# EAGLE design camara (EAGLE 9.6.1)
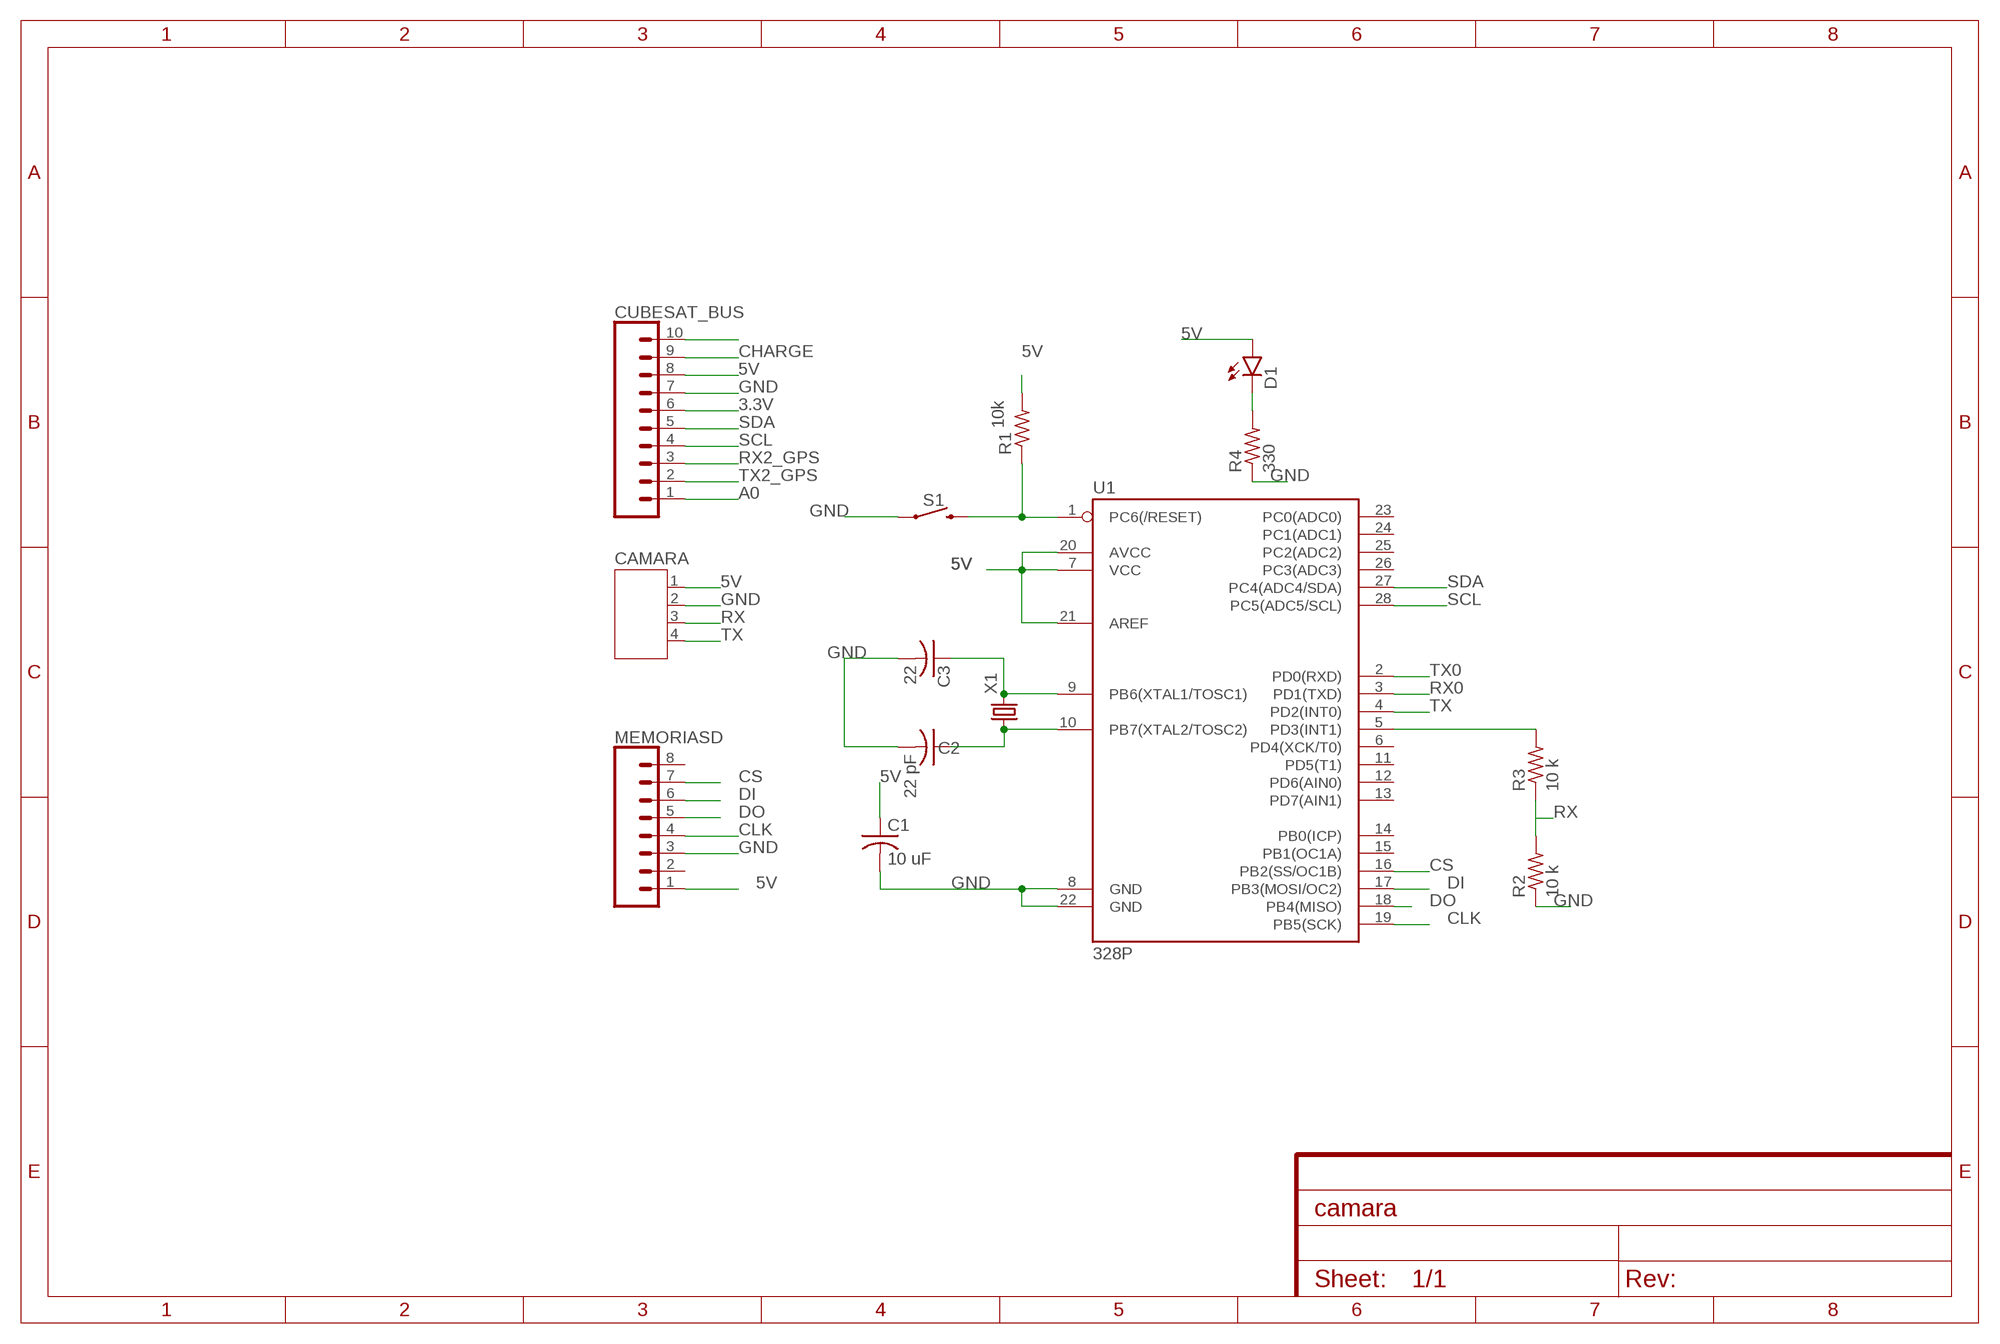
[diagram p0: schematic, sheet 1]

## Parts
C1  10 uF  C-US025-025X050  [C025-025X050]
C2  22 pF  C-US025-025X050  [C025-025X050]
C3  22  C-US025-025X050  [C025-025X050]
CAMARA  JST-PH4  [JST-PH4]
CUBESAT_BUS  CONN_10"  [1X10]
D1  BEAGLEBONE_BLUE_LED-3MM-NO_SILK  [BEAGLEBONE_BLUE_BEAGLEBONE_BLUE_LED3MM-NS]
MEMORIASD  CONN_08"  [1X08]
R1  R-US_0204/7  [0204/7]
R2  10 k  R-US_0204/7  [0204/7]
R3  10 k  R-US_0204/7  [0204/7]
R4  330  R-US_0204/7  [0204/7]
S1  MOMENTARY-SWITCH-SPST-PTH-6.0MM  [TACTILE_SWITCH_PTH_6.0MM]
U1  328P  ATMEGA328P_PDIP  [DIP28]
X1  CRYSTALS-NOGND-HC49  [HC49]

## Nets
3.3V: CUBESAT_BUS.6
5V: C1.1 CAMARA.1 CUBESAT_BUS.8 D1.A MEMORIASD.1 R1.2 U1.7(VCC) U1.20(AVCC) U1.21(AREF)
A0: CUBESAT_BUS.1
CHARGE: CUBESAT_BUS.9
CLK: MEMORIASD.4 U1.19(PB5(SCK))
CS: MEMORIASD.7 U1.16(PB2(SS/OC1B))
DI: MEMORIASD.6 U1.17(PB3(MOSI/OC2))
DO: MEMORIASD.5 U1.18(PB4(MISO))
GND: C1.2 C2.2 C3.2 CAMARA.2 CUBESAT_BUS.7 MEMORIASD.3 R2.1 R4.1 S1.1 U1.8(GND) U1.22(GND)
N$1: R1.1 S1.3 U1.1(PC6(/RESET))
N$2: C3.1 U1.9(PB6(XTAL1/TOSC1)) X1.2
N$3: C2.1 U1.10(PB7(XTAL2/TOSC2)) X1.1
N$4: R3.2 U1.5(PD3(INT1))
N$5: D1.K(C) R4.2
N$6: CUBESAT_BUS.10
RX: CAMARA.3 R2.2 R3.1
RX0: U1.3(PD1(TXD))
RX2_GPS: CUBESAT_BUS.3
SCL: CUBESAT_BUS.4 U1.28(PC5(ADC5/SCL))
SDA: CUBESAT_BUS.5 U1.27(PC4(ADC4/SDA))
TX: CAMARA.4 U1.4(PD2(INT0))
TX0: U1.2(PD0(RXD))
TX2_GPS: CUBESAT_BUS.2
Unconnected: MEMORIASD.2 MEMORIASD.8 U1.6(PD4(XCK/T0)) U1.11(PD5(T1)) U1.12(PD6(AIN0)) U1.13(PD7(AIN1)) U1.14(PB0(ICP)) U1.15(PB1(OC1A)) U1.23(PC0(ADC0)) U1.24(PC1(ADC1)) U1.25(PC2(ADC2)) U1.26(PC3(ADC3))

## Library data of the parts
C1-C3 = rcl:C-US: CAPACITOR, American symbol; SPICEPREFIX: C
CAMARA = jst-ph:JST-PH4
CUBESAT_BUS = SparkFun-Connectors:CONN_10: Multi connection point. Often used as Generic Header-pin footprint for 0.1 inch spaced/style header connections On any of the 0.1 inch spaced packages, you can populate with these: Break Away Headers - Straight <https://www.sparkfun.com/products/116> (PRT-00116) Break Away Male Headers - Right Angle <https://www.sparkfun.com/products/553> (PRT-00553) Female Headers <https://www.sparkfun.com/products/115> (PRT-00115) Break Away Headers - Machine Pin <https://www.sparkfun.com/products/117> (PRT-00117) Break Away Female Headers - Swiss Machine Pin <https://www.sparkfun.com/products/743> (PRT-00743) Arduino Stackable Header - 10 Pin <https://www.sparkfun.com/products/11376> (PRT-11376) For SCREWTERMINALS and SPRING TERMINALS visit here: Screw Terimnals on SparkFun.com <https://www.sparkfun.com/search/results?term=Screw+Terminals> (5mm/3.5mm/2.54mm spacing) This device is also useful as a general connection point to wire up your design to another part of your project. Our various solder wires solder well into these plated through hole pads. Hook-Up Wire - Assortment (Stranded, 22 AWG) <https://www.sparkfun.com/products/11375> (PRT-11375) Hook-Up Wire - Assortment (Solid Core, 22 AWG) <https://www.sparkfun.com/products/11367> (PRT-11367) View the entire wire category on our website here <https://www.sparkfun.com/categories/141> Special notes: Molex polarized connector foot print use with SKU : PRT-08231 with associated crimp pins and housings. 1MM SMD Version SKU: PRT-10208 NOTES ON THE VARIANTS LOCK and LOCK_LONGPADS... This footprint was designed to help hold the alignment of a through-hole component (i.e. 6-pin header) while soldering it into place. You may notice that each hole has been shifted either up or down by 0.005 of an inch from it's more standard position (which is a perfectly straight line). This slight alteration caused the pins (the squares in the middle) to touch the edges of the holes. Because they are alternating, it causes a "brace" to hold the component in place. 0.005 has proven to be the perfect amount of "off-center" position when using our standard breakaway headers. Although looks a little odd when you look at the bare footprint, once you have a header in there, the alteration is very hard to notice. Also,if you push a header all the way into place, it is covered up entirely on the bottom side.; PROD_ID: CONN-11563
D1 = BeagleBone_Blue_R3:BEAGLEBONE_BLUE_LED: LEDs Standard schematic elements and footprints for 5mm, 3mm, 1206, and 0603 sized LEDs. 5mm - Spark Fun Electronics SKU : COM-00529 (and others)
MEMORIASD = SparkFun-Connectors:CONN_08: Multi connection point. Often used as Generic Header-pin footprint for 0.1 inch spaced/style header connections On any of the 0.1 inch spaced packages, you can populate with these: Break Away Headers - Straight <https://www.sparkfun.com/products/116> (PRT-00116) Break Away Male Headers - Right Angle <https://www.sparkfun.com/products/553> (PRT-00553) Female Headers <https://www.sparkfun.com/products/115> (PRT-00115) Break Away Headers - Machine Pin <https://www.sparkfun.com/products/117> (PRT-00117) Break Away Female Headers - Swiss Machine Pin <https://www.sparkfun.com/products/743> (PRT-00743) Arduino Stackable Header - 8 Pin <https://www.sparkfun.com/products/9279> (PRT-09279) For SCREWTERMINALS and SPRING TERMINALS visit here: Screw Terimnals on SparkFun.com <https://www.sparkfun.com/search/results?term=Screw+Terminals> (5mm/3.5mm/2.54mm spacing) This device is also useful as a general connection point to wire up your design to another part of your project. Our various solder wires solder well into these plated through hole pads. Hook-Up Wire - Assortment (Stranded, 22 AWG) <https://www.sparkfun.com/products/11375> (PRT-11375) Hook-Up Wire - Assortment (Solid Core, 22 AWG) <https://www.sparkfun.com/products/11367> (PRT-11367) View the entire wire category on our website here <https://www.sparkfun.com/categories/141> Special notes: Molex polarized connector foot print use with SKU : PRT-08231 with associated crimp pins and housings. 1MM SMD Version SKU: PRT-10208 NOTES ON THE VARIANTS LOCK and LOCK_LONGPADS... This footprint was designed to help hold the alignment of a through-hole component (i.e. 6-pin header) while soldering it into place. You may notice that each hole has been shifted either up or down by 0.005 of an inch from it's more standard position (which is a perfectly straight line). This slight alteration caused the pins (the squares in the middle) to touch the edges of the holes. Because they are alternating, it causes a "brace" to hold the component in place. 0.005 has proven to be the perfect amount of "off-center" position when using our standard breakaway headers. Although looks a little odd when you look at the bare footprint, once you have a header in there, the alteration is very hard to notice. Also,if you push a header all the way into place, it is covered up entirely on the bottom side.; PROD_ID: CONN-08438
R1 = rcl:R-US_: RESISTOR, American symbol; SPICEPREFIX: 10k
R2-R4 = rcl:R-US_: RESISTOR, American symbol; SPICEPREFIX: R
S1 = SparkFun-Switches:MOMENTARY-SWITCH-SPST: Momentary Switch (Pushbutton) - SPST Normally-open (NO) SPST momentary switches (buttons, pushbuttons). Variants PTH-12MM - 12mm square, through-hole Momentary Pushbutton Switch - 12mm Square <https://www.sparkfun.com/products/9190> (COM-09190) PTH-6.0MM, PTH-6.0MM-KIT - 6.0mm square, through-hole Mini Pushbutton Switch <https://www.sparkfun.com/products/97> (COM-00097) KIT package intended for soldering kit's - only one side of pads' copper is exposed. PTH-RIGHT-ANGLE-KIT - Right-angle, through-hole Right Angle Tactile Button <https://www.sparkfun.com/products/10791> - Used on SparkFun BigTime Watch Kit <https://www.sparkfun.com/products/11734> SMD-12MM - 12mm square, surface-mount Tactile Button - SMD (12mm) <https://www.sparkfun.com/products/12993> (COM-12993) Used on SparkFun PicoBoard <https://www.sparkfun.com/products/11888> SMD-4.5MM - 4.5mm Square Trackball Switch Used on SparkFun Blackberry Trackballer Breakout <https://www.sparkfun.com/products/13169> SMD-4.6MMX2.8MM - 4.60mm x 2.80mm, surface mount Used on SparkFun SAMD21 Mini Breakout <https://www.sparkfun.com/products/13664> SMD-5.2MM, SMD-5.2-REDUNDANT - 5.2mm square, surface-mount Mini Pushbutton Switch - SMD <https://www.sparkfun.com/products/8720> (COM-08720) Used on Arduino Pro Mini <https://www.sparkfun.com/products/11114> REDUNDANT package connects both switch circuits together SMD-6.0X3.5MM - 6.0 x 3.5mm, surface mount Momentary Reset Switch SMD <https://www.sparkfun.com/products/8229> (COM-08229) SMD-6.2MM-TALL - 6.2mm square, surface mount Tactile Button - SMD (6mm) <https://www.sparkfun.com/products/12992> Used on SparkFun Digital Sandbox <https://www.sparkfun.com/products/12651> SMD-RIGHT-ANGLE - Right-angle, surface mount Used on SparkFun Block for Intel® Edison - Arduino <https://www.sparkfun.com/products/13036>; PROD_ID: SWCH-08441; SF_SKU: COM-00097
U1 = SparkFun-IC-Microcontroller:ATMEGA328P_PDIP: Atmel 328P Through hole ATMEGA328P uC used in the Arduino 32kb flash, 1k EEPROM, 2k SRAM Datasheet <http://www.sparkfun.com/datasheets/Components/SMD/ATMega328.pdf> SparkFun Products Storefront component: AVR 28 Pin 20MHz 32K 6A/D - ATMega328P <https://www.sparkfun.com/products/9061> (COM-09061) SparkFun Simon Says - Through-Hole Soldering Kit <https://www.sparkfun.com/products/10547> (KIT-10547) SparkFun Learn to Solder - Simon Says <https://www.sparkfun.com/products/13708> (KIT-13708) SparkFun BigTime Watch Kit <https://www.sparkfun.com/products/11734> (KIT-11734) SparkFun ClockIt <https://www.sparkfun.com/products/10930> (KIT-10930) SparkFun Serial Enabled LCD Kit <https://www.sparkfun.com/products/10097> (LCD-10097) SparkFun Simon Tilts - Through Hole Soldering Kit <https://www.sparkfun.com/products/12634> (KIT-12634) SparkFun Frequency Counter Kit <https://www.sparkfun.com/products/10140> (KIT-10140) FabFM Radio Kit <https://www.sparkfun.com/products/11043> (KIT-11043) SparkFun Binary Blaster Kit <https://www.sparkfun.com/products/12037> (KIT-12037) SparkFun Metro-Gnome <https://www.sparkfun.com/products/9236> (KIT-09236) ATmega328 with Arduino Optiboot (Uno) <https://www.sparkfun.com/products/10524> (DEV-10524); PROD_ID: IC-09136
X1 = IQD-Frequency-Products:CRYSTALS-NOGND: CRYSTALS CAN NOT GROUNDED

## Board
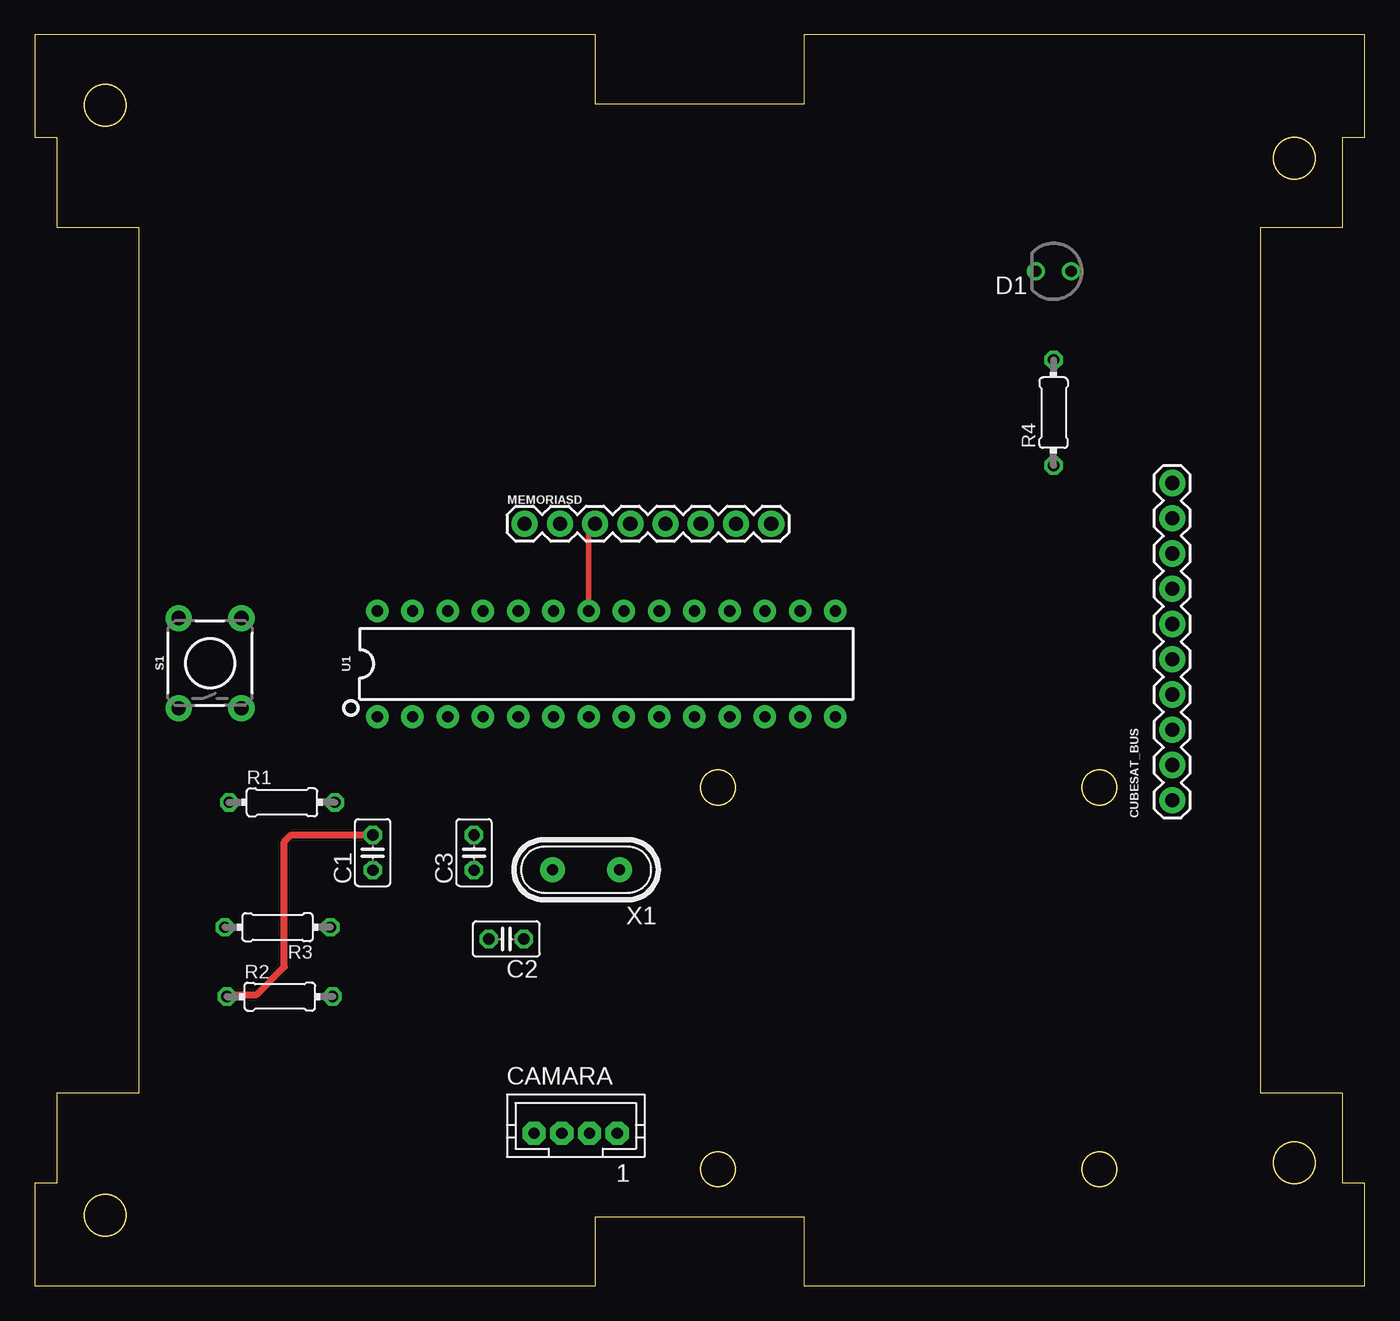
[diagram p1: board, top side]
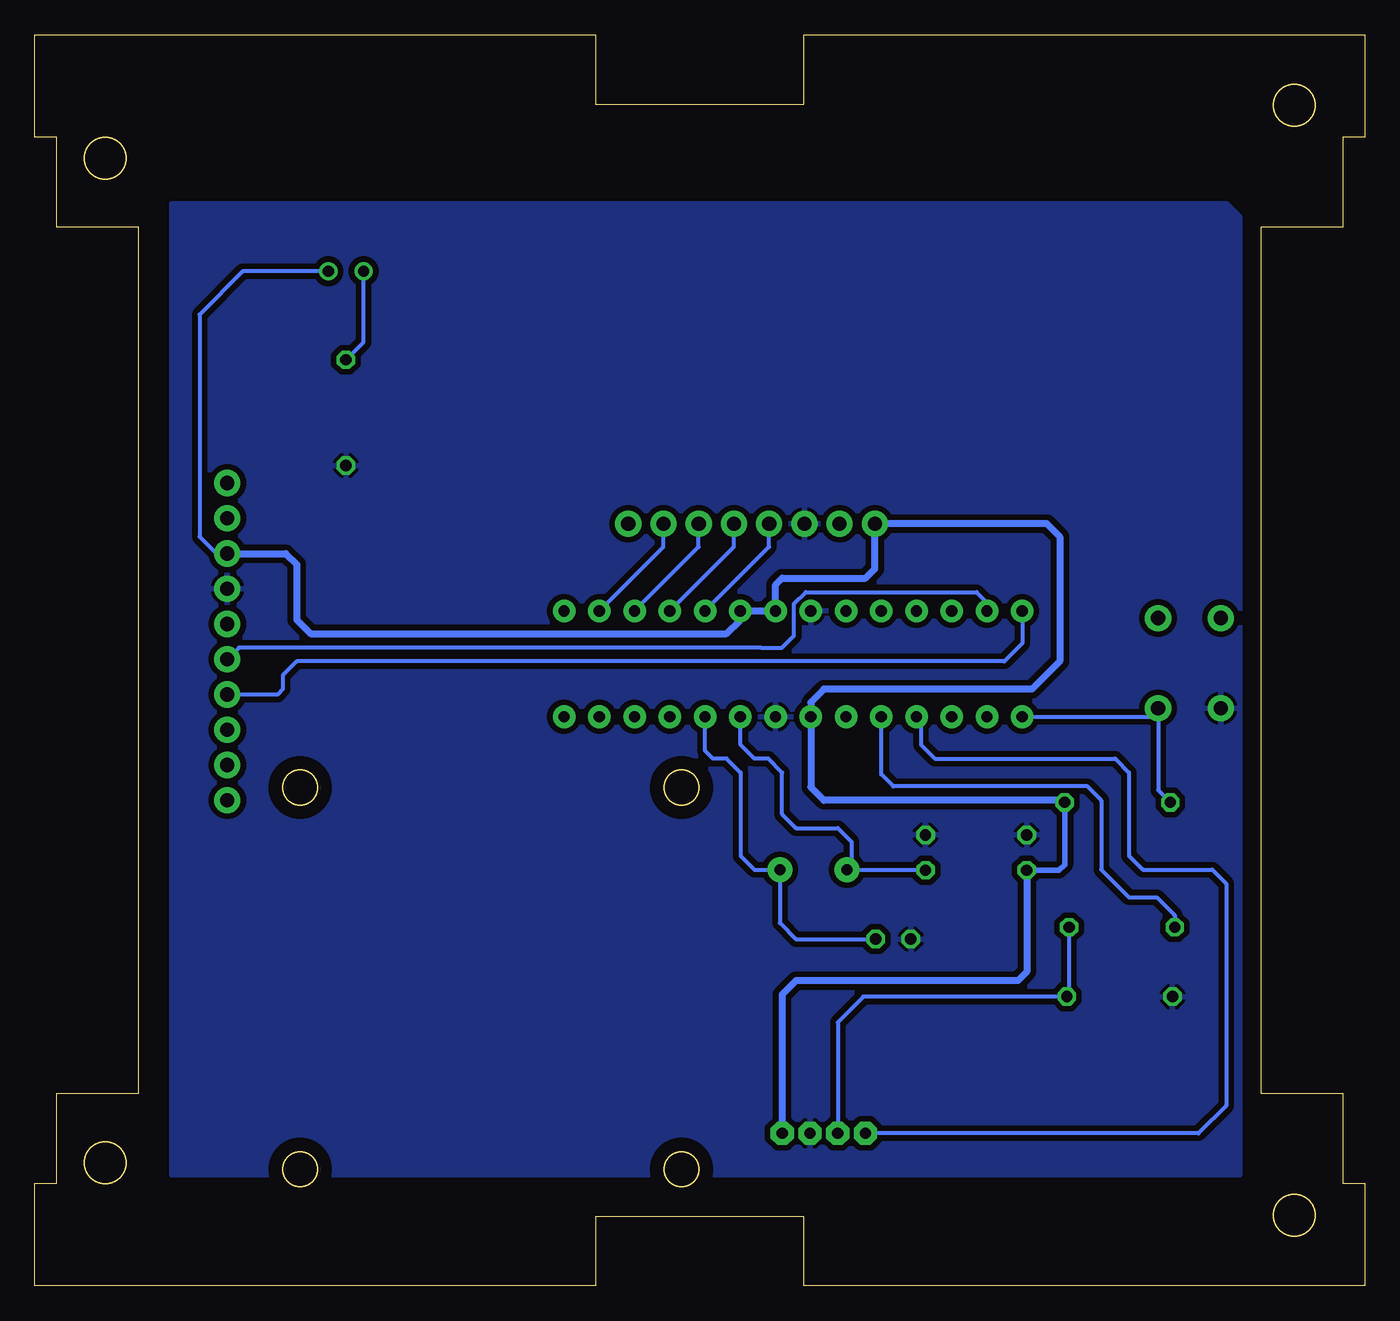
[diagram p2: board, bottom side, seen from below]

Size 95.89 x 90.17 mm. Coordinates in mm from the lower left corner, seen from the top.
Outline: 0,0 40.45,0 40.45,5 55.45,5 55.45,0 95.89,0 95.89,7.4 94.29,7.4 94.29,13.89 88.39,13.89 88.39,76.28 94.29,76.28 94.29,82.77 95.89,82.77 95.89,90.17 55.45,90.17 55.45,85.17 40.45,85.17 40.45,90.17 0,90.17 0,82.77 1.6,82.77 1.6,76.28 7.5,76.28 7.5,13.89 1.6,13.89 1.6,7.4 0,7.4 0,0
Outline: circle at 76.75,8.42 radius 1.25
Outline: circle at 90.81,8.89 radius 1.5
Outline: circle at 90.81,81.28 radius 1.5
Outline: circle at 49.25,8.42 radius 1.25
Outline: circle at 76.75,35.92 radius 1.25
Outline: circle at 5.08,85.09 radius 1.5
Outline: circle at 49.25,35.92 radius 1.25
Outline: circle at 5.08,5.08 radius 1.5
Copper layers (1*16): Top 0.035mm / dielectric 1.5mm / Bottom 0.035mm
Design rules "default *": minimum track width 10mil, minimum drill 0.35mm, track to track 10mil, track to pad 10mil, pad to pad 6mil, via to via 6mil, smd to smd 6mil, copper to edge 40mil, drill to drill 6mil, minimum pad ring 10mil, minimum via ring 8mil, stop-mask expansion 4mil, vias tented up to drill 0mil, thermal gap 10mil

### Footprints (pad centres in the part's own frame; a part is rotated, then mirrored left to right if it is on the bottom)
C025-025X050 = drill 0.813 octagon: 1 -1.27,0; 2 1.27,0
JST-PH4 = drill 0.813 pad 1.676 octagon: 1 3,0; 2 1,0; 3 -1,0; 4 -3,0
1X10 = drill 1.016 pad 1.88: 1 0,0; 2 2.54,0; 3 5.08,0; 4 7.62,0; 5 10.16,0; 6 12.7,0; 7 15.24,0; 8 17.78,0; 9 20.32,0; 10 22.86,0
BEAGLEBONE_BLUE_BEAGLEBONE_BLUE_LED3MM-NS = drill 0.813: A -1.27,0; K 1.27,0
1X08 = drill 1.016 pad 1.88: 1 0,0; 2 2.54,0; 3 5.08,0; 4 7.62,0; 5 10.16,0; 6 12.7,0; 7 15.24,0; 8 17.78,0
0204/7 = drill 0.813 octagon: 1 -3.81,0; 2 3.81,0
TACTILE_SWITCH_PTH_6.0MM = drill 1.016 pad 1.88: 1 -3.251,2.261; 2 3.251,2.261; 3 -3.251,-2.261; 4 3.251,-2.261
DIP28 = drill 0.813 pad 1.626: 1 -16.51,-3.81; 2 -13.97,-3.81; 3 -11.43,-3.81; 4 -8.89,-3.81; 5 -6.35,-3.81; 6 -3.81,-3.81; 7 -1.27,-3.81; 8 1.27,-3.81; 9 3.81,-3.81; 10 6.35,-3.81; 11 8.89,-3.81; 12 11.43,-3.81; 13 13.97,-3.81; 14 16.51,-3.81; 15 16.51,3.81; 16 13.97,3.81; 17 11.43,3.81; 18 8.89,3.81; 19 6.35,3.81; 20 3.81,3.81; 21 1.27,3.81; 22 -1.27,3.81; 23 -3.81,3.81; 24 -6.35,3.81; 25 -8.89,3.81; 26 -11.43,3.81; 27 -13.97,3.81; 28 -16.51,3.81
HC49 = drill 0.813 pad 1.8: 1 -2.413,0; 2 2.413,0

### Placement (x,y rotation side)
C1  24.37,31.23 90 top
C2  34,25 180 top
C3  31.67,31.23 90 top
CAMARA  39,11 0 top
CUBESAT_BUS  82,35 90 top
D1  73.45,73.12 180 top
MEMORIASD  35.32,54.93 0 top
R1  17.83,34.85 0 top
R2  17.67,20.85 0 top
R3  17.51,25.85 180 top
R4  73.45,62.93 90 top
S1  12.64,44.88 90 top
U1  41.21,44.83 0 top
X1  39.75,29.99 180 top

### Tracks (layer width: path | path; a pad name or v marks a point on that pad's centre or on a via)
5V
  Bottom 0.305: D1.A 80.88,73.12 84,70 84,54 82.78,52.78 CUBESAT_BUS.8
  Bottom 0.406: R1.2 21.64,30.36 22.04,29.96 C1.1
  Bottom 0.508: R1.2 21.79,35 39,35 39.94,35.94 U1.7 39.94,42.06 39,43 24,43 22,45 22,54 22.93,54.93 MEMORIASD.1 35.32,51.68 36,51 42,51 42.48,50.52 U1.21 U1.20 45.02,47.98 46,47 76,47 77,48 77,52 77.78,52.78 CUBESAT_BUS.8 | C1.1 24.37,22.63 25,22 41,22 42,21 CAMARA.1
CLK
  Bottom 0.305: U1.19 42.94,53.26 MEMORIASD.4
CS
  Bottom 0.305: U1.16 50.56,53.26 MEMORIASD.7
DI
  Bottom 0.305: U1.17 48.02,53.26 MEMORIASD.6
DO
  Bottom 0.305: U1.18 45.48,53.26 MEMORIASD.5
GND
  Top 0.406: U1.22 39.94,54.47 MEMORIASD.3
  Top 0.508: R2.1 14.01,21 16,21 18,23 18,32 18.5,32.5 C1.2
  pour Bottom (isolate 0.406): 9,77 9,8 86,8 86,78 10,78
N$1
  Bottom 0.305: U1.1 15.51,41.02 S1.3 14.9,35.73 R1.1
N$2
  Bottom 0.305: X1.2 37,29.99 | 37,29.99 31.7,29.99 C3.1 | U1.9 45,41 45,39 44,38 43,38 42,37 42,34 41,33 38,33 37,32 37,29.99
N$3
  Bottom 0.305: U1.10 47.56,38.56 47,38 46,38 45,37 45,31 43.99,29.99 X1.1 42.16,26.16 41,25 C2.1
N$4
  Bottom 0.305: R3.2 13.7,26.7 15,28 17,28 19,30 19,35 20,36 34,36 34.86,36.86 U1.5
N$5
  Bottom 0.305: R4.2 72.18,68.01 D1.K
RX
  Bottom 0.305: R3.1 21.32,21.01 R2.2 36.15,20.85 38,19 CAMARA.3
SCL
  Bottom 0.305: U1.28 24.7,46.3 26,45 77,45 78,44 78,43 78.38,42.62 CUBESAT_BUS.4
SDA
  Bottom 0.305: CUBESAT_BUS.5 81.16,46 44,46 43.54,46 42,46 41.16,46.84 41.16,49.15 40.3,50 28,50 27.24,49.24 U1.27
TX
  Bottom 0.305: CAMARA.4 12,11 10,13 10,29 11,30 16,30 17,31 17,37 18,38 31,38 32,39 32,40.7 U1.4